# Altium schematic sheet DAQ.SchDoc
size A4; SheetNumber: 3; SheetTotal: 7
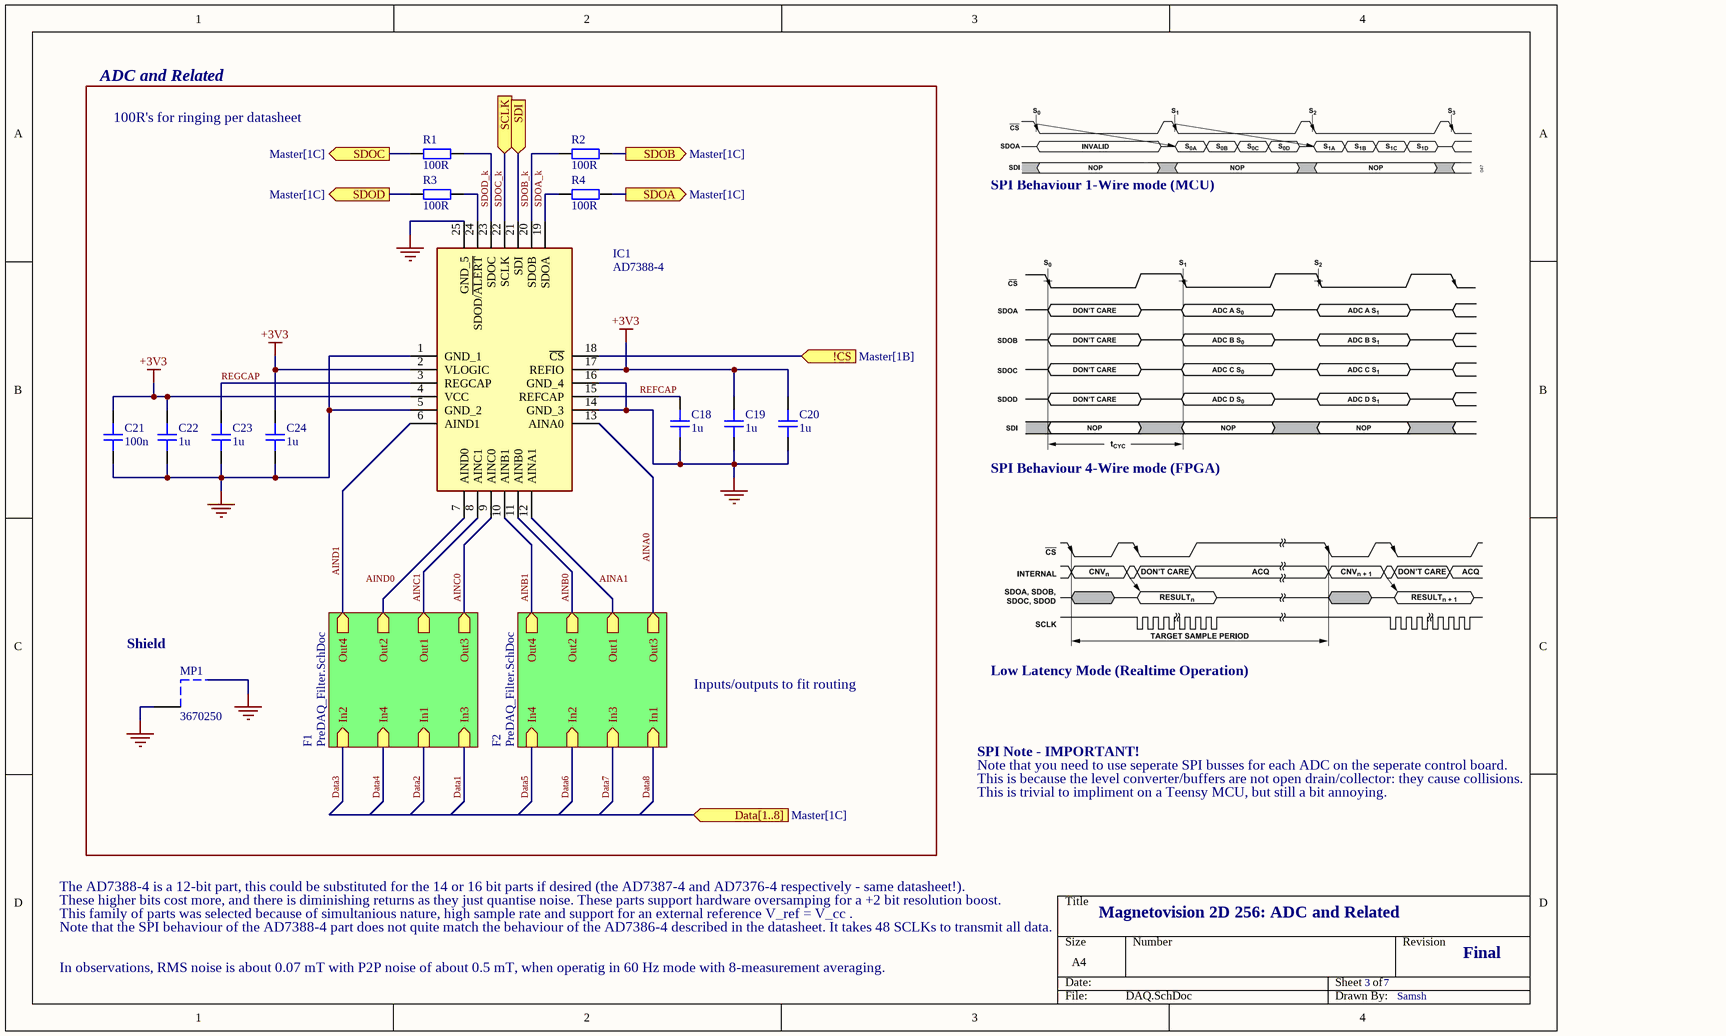
[diagram p0: DAQ.SchDoc]

## Parts
C18  1u  [CAP_0603]
C19  1u  [CAP_0603]
C20  1u  [CAP_0603]
C21  100n  [CAP_0603]
C22  1u  [CAP_0603]
C23  1u  [CAP_0603]
C24  1u  [CAP_0603]
IC1  AD7388-4  [QFN50P400X400X60-25N-D]
MP1  3670250  [3670250]
R1  100R  [RES_0603]
R2  100R  [RES_0603]
R3  100R  [RES_0603]
R4  100R  [RES_0603]

## Sub-sheets
F1 = PreDAQ_Filter.SchDoc: In1 (in), Out1 (out), In2 (in), Out2 (out), In4 (in), Out4 (out), In3 (in), Out3 (out)
F2 = PreDAQ_Filter.SchDoc: In1 (in), Out1 (out), In2 (in), Out2 (out), In4 (in), Out4 (out), In3 (in), Out3 (out)

## Ports
!CS (in, see Master[1B]), Data[1..8] (in, see Master[1C]), SCLK (in, see Master[1B]), SDI (in, see Master[1B]), SDOA (out, see Master[1C]), SDOB (out, see Master[1C]), SDOC (out, see Master[1C]), SDOD (out, see Master[1C])

## Nets
+3V3: C19.2 C20.2 C21.2 C22.2 C24.2 IC1.2(VLOGIC) IC1.4(VCC) IC1.17(REFIO)
GND: C18.1 C19.1 C20.1 C21.1 C22.1 C23.1 C24.1 IC1.1(GND_1) IC1.5(GND_2) IC1.14(GND_3) IC1.16(GND_4) IC1.25(GND_5) MP1.1
!CS: IC1.18(~{CS}) ; port !CS
AINA0: IC1.13(AINA0) ; sheet F2/Out3
AINA1: IC1.12(AINA1) ; sheet F2/Out1
AINB0: IC1.11(AINB0) ; sheet F2/Out2
AINB1: IC1.10(AINB1) ; sheet F2/Out4
AINC0: IC1.9(AINC0) ; sheet F1/Out3
AINC1: IC1.8(AINC1) ; sheet F1/Out1
AIND0: IC1.7(AIND0) ; sheet F1/Out2
AIND1: IC1.6(AIND1) ; sheet F1/Out4
Data1: sheet F1/In3
Data2: sheet F1/In1
Data3: sheet F1/In2
Data4: sheet F1/In4
Data5: sheet F2/In4
Data6: sheet F2/In2
Data7: sheet F2/In3
Data8: sheet F2/In1
REFCAP: C18.2 IC1.15(REFCAP)
REGCAP: C23.2 IC1.3(REGCAP)
SCLK: IC1.22(SCLK) ; port SCLK
SDI: IC1.21(SDI) ; port SDI
SDOA: R4.1 ; port SDOA
SDOA_k: IC1.19(SDOA) R4.2
SDOB: R2.1 ; port SDOB
SDOB_k: IC1.20(SDOB) R2.2
SDOC: R1.2 ; port SDOC
SDOC_k: IC1.23(SDOC) R1.1
SDOD: R3.2 ; port SDOD
SDOD_k: IC1.24(SDOD/~{ALERT}) R3.1

## Notes on the sheet
- ADC and Related
- 100R's for ringing per datasheet
- SPI Behaviour 1-Wire mode (MCU)
- SPI Behaviour 4-Wire mode (FPGA)
- Shield
- Inputs/outputs to fit routing
- Low Latency Mode (Realtime Operation)
- Note that you need to use seperate SPI busses for each ADC on the seperate control board.
- This is because the level converter/buffers are not open drain/collector: they cause collisions.
- SPI Note - IMPORTANT!
- This is trivial to impliment on a Teensy MCU, but still a bit annoying.
- The AD7388-4 is a 12-bit part, this could be substituted for the 14 or 16 bit parts if desired (the AD7387-4 and AD7376-4 respectively - same datasheet!).
- These higher bits cost more, and there is diminishing returns as they just quantise noise. These parts support hardware oversamping for a +2 bit resolution boost.
- This family of parts was selected because of simultanious nature, high sample rate and support for an external reference V_ref = V_cc .
- Magnetovision 2D 256: ADC and Related
- In observations, RMS noise is about 0.07 mT with P2P noise of about 0.5 mT, when operatig in 60 Hz mode with 8-measurement averaging.
- Note that the SPI behaviour of the AD7388-4 part does not quite match the behaviour of the AD7386-4 described in the datasheet. It takes 48 SCLKs to transmit all data.
- 3
- 7
- Final
- Samsh

## Library data of the parts
C18-C24 = CMP-001-00085-1: Capacitor SMD 0603; Distributor Link: *; LCSC: *; Design Item ID: CAP_0603; Rating: *; Source: Schematic-Lib-PhilsLab.SchLib; Manufacturer Part Number: *; Manufacturer: *; Dielectric: *
IC1 = CMP-031-00040-2: Single-Ended Input, Quad, Simultaneous Sampling, 16-Bit, SAR ADC; Manufacturer_Name: Analog Devices; Height: 0.6mm; Source: SamacSys.SchLib; Manufacturer_Part_Number: AD7386-4BCPZ; Arrow Price/Stock: https://www.arrow.com/en/products/ad7386-4bcpz/analog-devices?region=nac; Arrow Part Number: AD7386-4; Mouser Price/Stock: https://www.mouser.co.uk/ProductDetail/Analog-Devices/AD7386-4BCPZ?qs=ST9lo4GX8V1C1Qgul%252B8gdQ%3D%3D; Datasheet Link: https://www.analog.com/AD7386-4/datasheet; Mouser Part Number: 584-AD7386-4BCPZ; Design Item ID: AD7386-4BCPZ
MP1 = CMP-03913-115851622-1: 3670250 Shield Cabinet Frame, 25Mm X 21Mm Rohs Compliant: Yes; Core Material: Steel; Max Operating Temperature: 125°C; Height: 4mm; RoHS: Compliant; Length: 25mm; Width: 21mm; NexarPartId: 115851622; Min Operating Temperature: -40°C
R1-R4 = CMP-009-00179-1: Resistor SMD 0603; Manufacturer Part Number: *; Distributor Link: *; Source: Schematic-Lib-PhilsLab.SchLib; Manufacturer: *; Design Item ID: RES_0603; LCSC: *